# Altium schematic sheet 2015-05-17_13-58-061.schdoc
size 269 x 165 mm; SheetNumber: 1; SheetTotal: 1
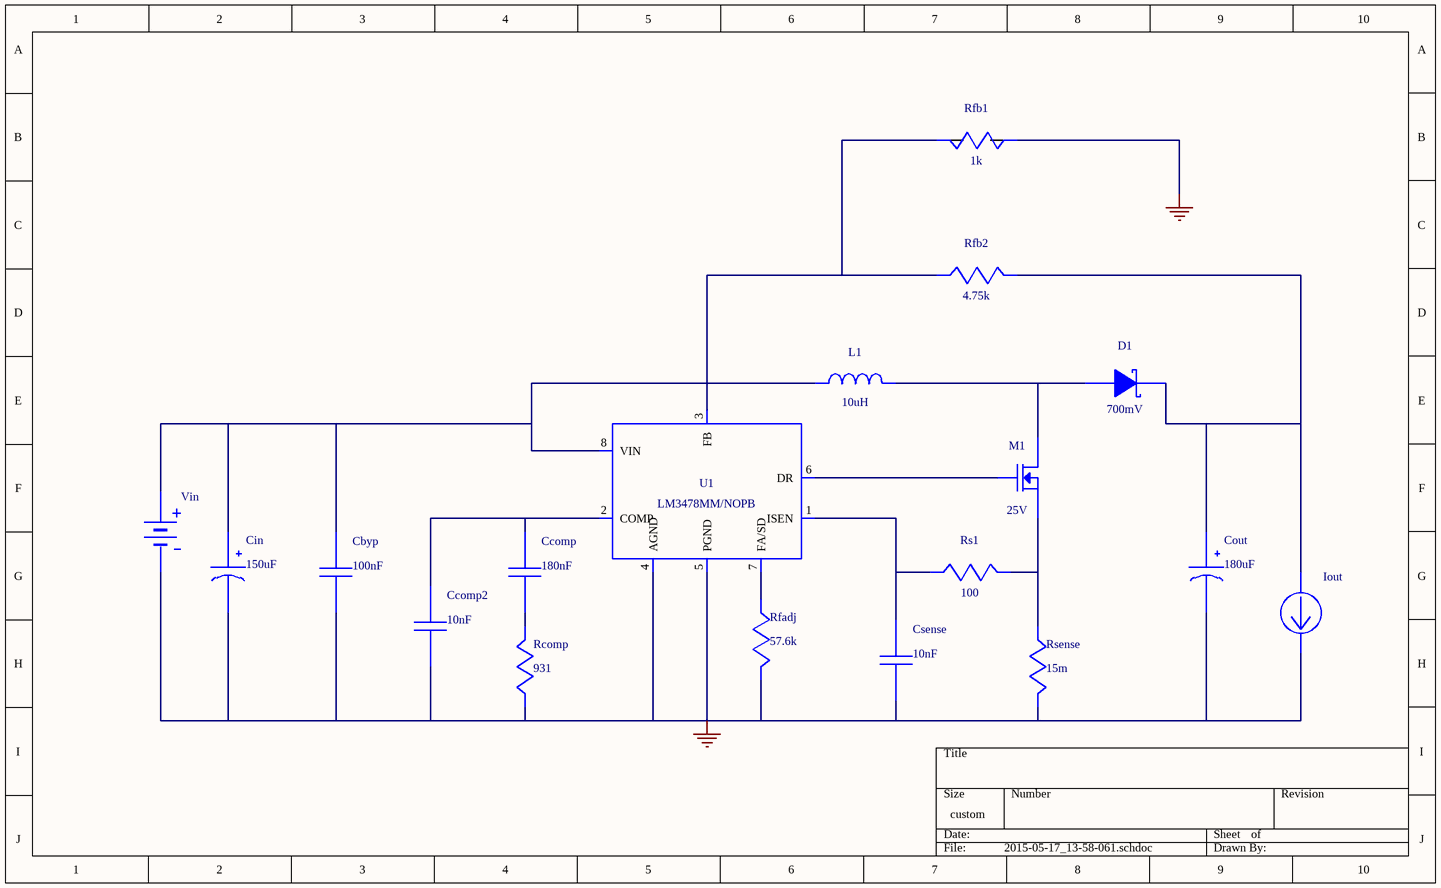
[diagram p0: 2015-05-17_13-58-061.schdoc]

## Parts
Cbyp  value 100nF  (hidden comment: C1005X5R0J104K)
Ccomp  value 180nF  (hidden comment: GRM155R61A184KE19D)
Ccomp2  value 10nF  (hidden comment: GRM216R71H103KA01D)
Cin  value 150uF  (hidden comment: EEE-FK1A151P)
Cout  value 180uF  (hidden comment: 16SVPE180M)
Csense  value 10nF  (hidden comment: GRM216R71H103KA01D)
D1  value 700mV  (hidden comment: B560C-13-F)
Iout  WB_CURRENT_LOAD  (value not drawn)
L1  value 10uH  (hidden comment: SRR1208-100ML)
M1  value 25V  (hidden comment: CSD16340Q3)
Rcomp  value 931  (hidden comment: CRCW0402931RFKED)
Rfadj  value 57.6k  (hidden comment: CRCW040257K6FKED)
Rfb1  value 1k  (hidden comment: CRCW04021K00FKED)
Rfb2  value 4.75k  (hidden comment: CRCW04024K75FKED)
Rs1  value 100  (hidden comment: CRCW0402100RFKED)
Rsense  value 15m  (hidden comment: CSR1206FK15L0)
U1  LM3478MM/NOPB
Vin  WB_BATTERY  (value not drawn)

## Nets
0: Cbyp.2 Ccomp2.2 Cin.2(-) Cout.2(-) Csense.2 Iout.2(-) Rcomp.2 Rfadj.1 Rsense.1 U1.4(AGND) U1.5(PGND) Vin.2(-)
NetCbyp_1: Cbyp.1 Cin.1(+) L1.1 U1.8(VIN) Vin.1(+)
NetCcomp_1: Ccomp.1 Ccomp2.1 U1.2(COMP)
NetCcomp_2: Ccomp.2 Rcomp.1
NetCout_1: Cout.1(+) D1.1(K) Iout.1(+) Rfb2.1
NetCsense_1: Csense.1 Rs1.2 U1.1(ISEN)
NetD1_2: D1.2(A) L1.2 M1.5(Drain) M1.6(Drain) M1.7(Drain) M1.8(Drain) M1.9(Drain)
NetM1_1: M1.1(Source) M1.2(Source) M1.3(Source) Rs1.1 Rsense.2
NetM1_4: M1.4(Gate) U1.6(DR)
NetRfadj_2: Rfadj.2 U1.7(FA/SD)
NetRfb2_2: Rfb2.2 U1.3(FB)

Not connected (* = marked no-connect by the designer): Rfb1 1 2

## Library data of the parts
Cbyp = C1005X5R0J104K: Manufacturer Name: TDK; PackageReference: C1005X5R0J104K; Manufacturer Part Number: C1005X5R0J104K
Ccomp = GRM155R61A184KE19D: GRM155R61A184KE1; Manufacturer Name: MuRata; PackageReference: GRM155R61A184KE19D; Manufacturer Part Number: GRM155R61A184KE19D
Ccomp2 Csense = GRM216R71H103KA01D: GRM216R71H103KA0; Manufacturer Name: MuRata; PackageReference: GRM216R71H103KA01D; Manufacturer Part Number: GRM216R71H103KA01D
Cin = EEE-FK1A151P: Manufacturer Name: Panasonic; PackageReference: EEE-FK1A151P; Manufacturer Part Number: EEE-FK1A151P
Cout = 16SVPE180M: Manufacturer Name: Panasonic; PackageReference: 16SVPE180M; Manufacturer Part Number: 16SVPE180M
D1 = B560C-13-F: Manufacturer Name: Diodes Inc.; PackageReference: B560C-13-F; Manufacturer Part Number: B560C-13-F
Iout = WB_CURRENT_LOAD: Value: UNLISTED; PackageReference: WB_CURRENT_LOAD; Manufacturer Part Number: WB_CURRENT_LOAD; Manufacturer Name: WB_CURRENT_LOAD
L1 = SRR1208-100ML: Manufacturer Name: Bourns; PackageReference: SRR1208-100ML; Manufacturer Part Number: SRR1208-100ML
M1 = CSD16340Q3: Manufacturer Name: Texas Instruments; PackageReference: CSD16340Q3; Manufacturer Part Number: CSD16340Q3
Rcomp = CRCW0402931RFKED: Manufacturer Name: Vishay-Dale; PackageReference: CRCW0402931RFKED; Manufacturer Part Number: CRCW0402931RFKED
Rfadj = CRCW040257K6FKED: Manufacturer Name: Vishay-Dale; PackageReference: CRCW040257K6FKED; Manufacturer Part Number: CRCW040257K6FKED
Rfb1 = CRCW04021K00FKED: Manufacturer Name: Vishay-Dale; PackageReference: CRCW04021K00FKED; Manufacturer Part Number: CRCW04021K00FKED
Rfb2 = CRCW04024K75FKED: Manufacturer Name: Vishay-Dale; PackageReference: CRCW04024K75FKED; Manufacturer Part Number: CRCW04024K75FKED
Rs1 = CRCW0402100RFKED: Manufacturer Name: Vishay-Dale; PackageReference: CRCW0402100RFKED; Manufacturer Part Number: CRCW0402100RFKED
Rsense = CSR1206FK15L0: Manufacturer Name: Stackpole Electronics Inc; PackageReference: CSR1206FK15L0; Manufacturer Part Number: CSR1206FK15L0
U1 = LM3478MM/NOPB: Manufacturer Name: Texas Instruments; Value: UNLISTED; PackageReference: LM3478MM/NOPB; Manufacturer Part Number: LM3478MM/NOPB
Vin = WB_BATTERY: Value: UNLISTED; PackageReference: WB_BATTERY; Manufacturer Part Number: WB_BATTERY; Manufacturer Name: WB_BATTERY